# Altium schematic sheet Supplies.SchDoc
size A4; SheetNumber: 2; SheetTotal: 2
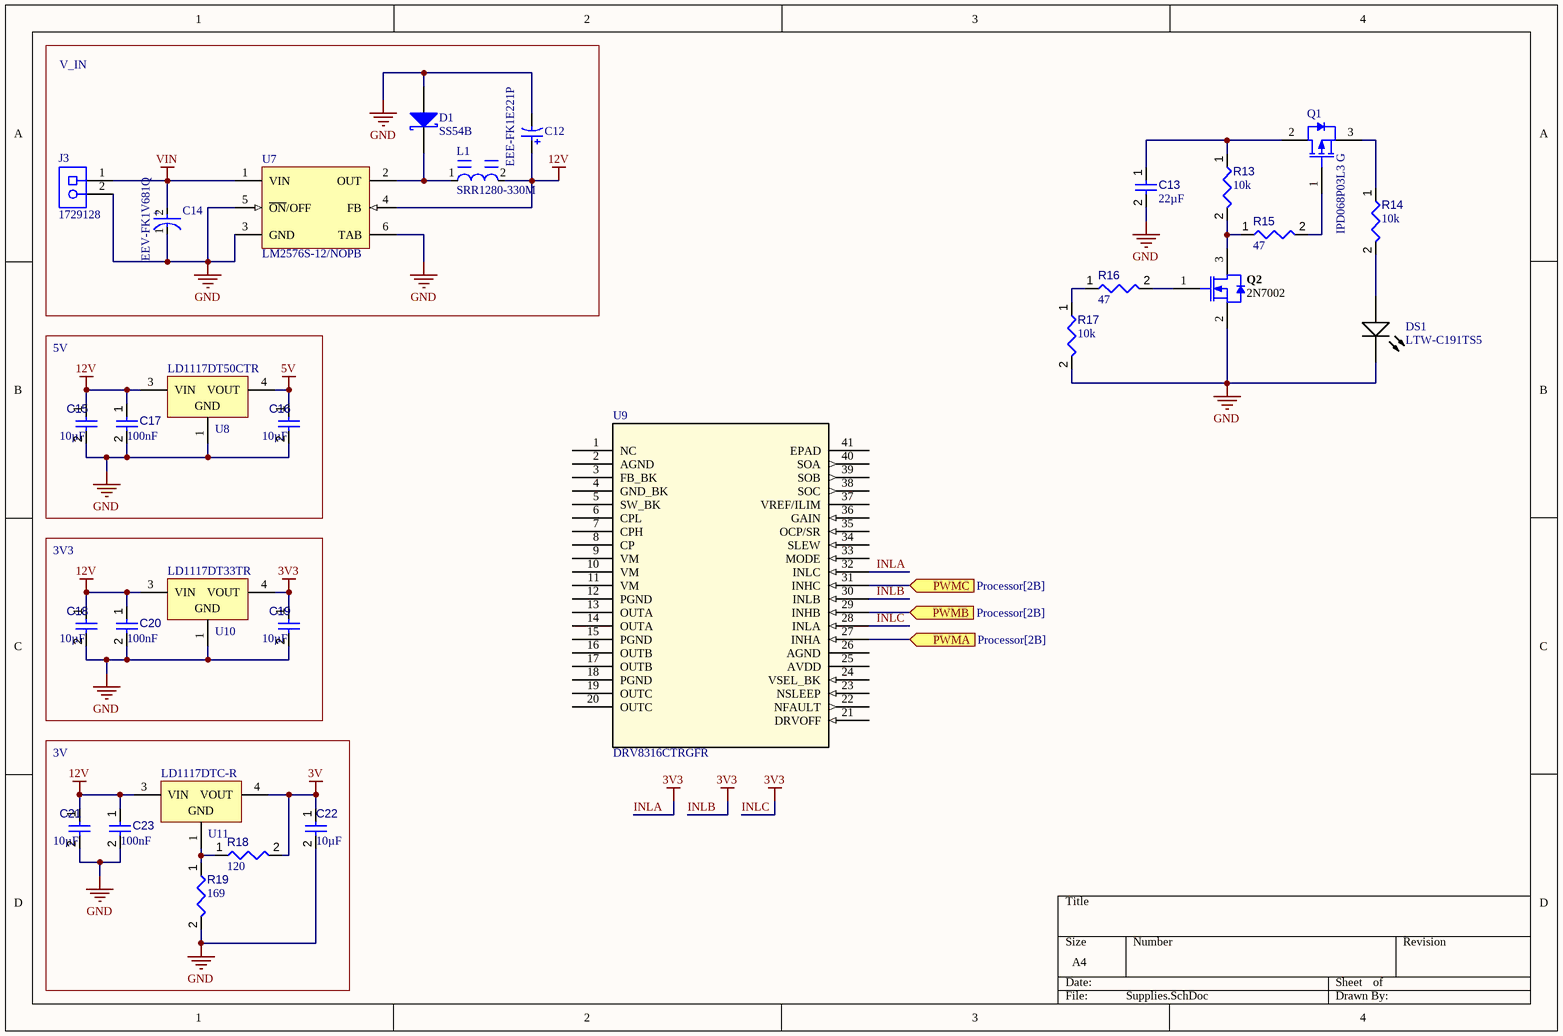
[diagram p0: Supplies.SchDoc]

## Parts
C12  EEE-FK1E221P  [PNSC-EEE-FK1E221P_N]
C13  value 22µF  [CAPC0805(2012)145_L]  (hidden comment: Capacitor 22µF +/-40% 16V 0805)
C14  EEV-FK1V681Q  [FP-FKH13-MFG]
C15  value 10µF  [CAPC0805(2012)145_L]  (hidden comment: Capacitor 22µF +/-40% 16V 0805)
C16  value 10µF  [CAPC0805(2012)145_L]  (hidden comment: Capacitor 22µF +/-40% 16V 0805)
C17  value 100nF  [CAPC1608X90X40NL10T20]  (hidden comment: Capacitor 100 nF +/-10% 50 V 0603)
C18  value 10µF  [CAPC0805(2012)145_L]  (hidden comment: Capacitor 22µF +/-40% 16V 0805)
C19  value 10µF  [CAPC0805(2012)145_L]  (hidden comment: Capacitor 22µF +/-40% 16V 0805)
C20  value 100nF  [CAPC1608X90X40NL10T20]  (hidden comment: Capacitor 100 nF +/-10% 50 V 0603)
C21  value 10µF  [CAPC0805(2012)145_L]  (hidden comment: Capacitor 22µF +/-40% 16V 0805)
C22  value 10µF  [CAPC0805(2012)145_L]  (hidden comment: Capacitor 22µF +/-40% 16V 0805)
C23  value 100nF  [CAPC1608X90X40NL10T20]  (hidden comment: Capacitor 100 nF +/-10% 50 V 0603)
D1  SS54B  [JCET-SMB-2_M]
DS1  LTW-C191TS5  [LTST-LTW-C191TS5_V]
J3  1729128  [PHOE-1729128-2_V]
L1  SRR1280-330M  [FP-SRR1280-MFG]
Q1  IPD068P03L3 G  [INF-PG-TO252-3-1_L]
Q2  2N7002  [INF-PG-SOT23_M]
R13  value 10k  [RESC1608X55X25ML10T15]  (hidden comment: Resistor 10k +/-1% 0603 100 mW)
R14  value 10k  [RESC1608X55X25ML10T15]  (hidden comment: Resistor 10k +/-1% 0603 100 mW)
R15  value 47  [RESC1608X55X25ML10T15]  (hidden comment: Resistor 10k +/-1% 0603 100 mW)
R16  value 47  [RESC1608X55X25ML10T15]  (hidden comment: Resistor 10k +/-1% 0603 100 mW)
R17  value 10k  [RESC1608X55X25ML10T15]  (hidden comment: Resistor 10k +/-1% 0603 100 mW)
R18  value 120  [RESC1608X55X25ML10T15]  (hidden comment: Resistor 10k +/-1% 0603 100 mW)
R19  value 169  [RESC1608X55X25ML10T15]  (hidden comment: Resistor 10k +/-1% 0603 100 mW)
U7  LM2576S-12/NOPB  [KTT0005B_N]
U8  LD1117DT50CTR  [TO-252_N]
U9  DRV8316CTRGFR  [VQFN40_RGF_TEX]
U10  LD1117DT33TR  [TO-252_N]
U11  LD1117DTC-R  [TO-252_M]

## Blocks framed on the sheet
V_IN: C12 C14 D1 J3 L1 U7
5V: C15-C17 U8
3V3: C18-C20 U10
3V: C21-C23 R18 R19 U11

## Ports
PWMA (in, see Processor[2B]), PWMB (in, see Processor[2B]), PWMC (in, see Processor[2B])

## Nets
3V: C22.1 R18.2 U11.4(VOUT)
5V: C16.1 U8.4(VOUT)
12V: C12.1 C15.1 C17.1 C18.1 C20.1 C21.1 C23.1 L1.2 U7.4(FB) U8.3(VIN) U10.3(VIN) U11.3(VIN)
GND: C12.2 C13.2 C14.1(C) C15.2 C16.2 C17.2 C18.2 C19.2 C20.2 C21.2 C22.2 C23.2 D1.1(A) DS1.2(K) J3.2 Q2.2(SOURCE) R17.2 R19.2 U7.3(GND) U7.5(~{ON}/OFF) U7.6(TAB) U8.1(GND) U10.1(GND)
INLA: C19.1 U9.28(INLA) U9.30(INLB) U9.32(INLC) U10.4(VOUT)  [also labelled 3V3, INLB, INLC]
VIN: C14.2(A) J3.1 U7.1(VIN)
PWMA: U9.27(INHA) ; port PWMA
PWMB: U9.29(INHB) ; port PWMB
PWMC: U9.31(INHC) ; port PWMC
NetC13_1: C13.1 Q1.2(DRAIN) R13.1
NetD1_2: D1.2(K) L1.1 U7.2(OUT)
NetDS1_1: DS1.1(A) R14.2
NetQ1_1: Q1.1(GATE) R15.2
NetQ1_3: Q1.3(SOURCE) R14.1
NetQ2_1: Q2.1(GATE) R16.2
NetQ2_3: Q2.3(DRAIN) R13.2 R15.1
NetR16_1: R16.1 R17.1
NetR18_1: R18.1 R19.1 U11.1(GND)

Not connected (* = marked no-connect by the designer): U9 1(NC) 2(AGND) 3(FB_BK) 4(GND_BK) 5(SW_BK) 6(CPL) 7(CPH) 8(CP) 9(VM) 10(VM) 11(VM) 12(PGND) 13(OUTA) 14(OUTA) 15(PGND) 16(OUTB) 17(OUTB) 18(PGND) 19(OUTC) 20(OUTC) 21(DRVOFF) 22(NFAULT) 23(NSLEEP) 24(VSEL_BK) 25(AVDD) 26(AGND) 33(MODE) 34(SLEW) 35(OCP/SR) 36(GAIN) 37(VREF/ILIM) 38(SOC) 39(SOB) 40(SOA) 41(EPAD)

## Notes on the sheet
- (in symbol CMP-05427-002172-1) +

## Library data of the parts
C12 = CMP-1665-00017-3: Aluminum Electrolytic Capacitor, 220 uF, +/- 20%, 25 V, -55 to 105 degC, 2-Pin CAPAE, RoHS, Tape and Reel; Manufacturer: Panasonic; Voltage Rating: 25 V; ComponentLink2URL: http://industrial.panasonic.com/cdbs/www-data/pdf/RDE0000/ABA0000C1181.pdf; Height: 10.2 mm; Max Operating Temperature: 105 degC; PackageReference: EEE-FK1E221P; ComponentLink1Description: Manufacturer URL; ComponentLink1URL: http://www.panasonic.com/; Mount: Surface Mount; REACH SVHC: No SVHC; Min Operating Temperature: -55 degC; ComponentLink2Description: Datasheet; DatasheetVersion: 03/2016; Length: 10.2 mm; RoHSCompliant: true; Packaging: Tape and Reel; Package Quantity: 500; Lead Pitch: 3.1 mm; Pins: 2; PackageDescription: 2-Pin Electrolytic Aluminum Capacitor, Body 8.3 x 8.3 mm; Mounting Technology: Surface Mount
C13 C15 C16 C18 C19 C21 C22 = CMP-001-00081-4: Chip Capacitor, 22µF +/-40%, 16V, 0805, Thickness 1.45 mm; Tolerance: 5%; Voltage Rating: 16V; Mounting Technology: SMT; Pins: 2; Max Operating Temperature: 85°C; Case/Package: 0805; Min Operating Temperature: -55°C
C14 = CMP-05427-002172-1: CAP ALUM 680UF 20% 35V SMD; Ripple Current (AC): 1.1A; Life (Hours): 5000Hour; Material: Aluminium; ESR (Equivalent Series Resistance): 60mR; Leakage Current: 3uA; Max Operating Temperature: 105°C; Min Operating Temperature: -55°C; Reach SVHC Compliant: Yes; Radiation Hardening: No; Length: 14mm; Package Quantity: 200; Width: 900um; Mount: Surface Mount; Ripple Current: 1.1A; Lead Free: Lead Free; Case/Package: Radial; Voltage Rating (DC): 35V; Termination: SMD/SMT; Capacitance: 680uF; Series: FK; Packaging: Tape and Reel; Voltage: 35V; Height: 13.5mm; Construction: Cylindrical; Voltage Rating: 35V; Ratings: AEC-Q200; Contact Plating: Tin; Impedance: 60mR; Height - Seated (Max): 0.531inch; Diameter: 12.5mm; RoHS Compliant: Yes; Tolerance: 20%
C17 C20 C23 = CMP-001-00017-6: Chip Capacitor, 100 nF, +/- 10%, 50 V, 0603 (1608 Metric); Capacitor Type: Ceramic; Voltage Rating: 50V; Max Operating Temperature: 125°C; Min Operating Temperature: -55°C; Case/Package: 0603; Mounting Technology: SM; Pins: 2; Tolerance: 10%; RoHS Compliant: True
D1 = CMP-2100-03685-1: Schottky Barrier Rectifier, 40 V, 5 A, -55 to 150 degC, 2-Pin SMD; Manufacturer: JCET; Datasheet URL: http://wiki.seeedstudio.com/images/3/3f/0310130P1.pdf; Package Description: 2-Pin Surface Mount Device, Body 4.315 x 3.62 mm; Datasheet Version: 41395.0; Package Reference: SMB-2; Manufacturer URL: http://www.cj-elec.com/
DS1 = CMP-007-00027-2: LED Uni-Color White, 70 mW, 20 mA, -20 to 80 degC, 2-Pin SMD, RoHS, Tape and Reel; Manufacturer: Lite-On; Power: 70mW; Forward Current: 5mA; Viewing Angle: 130degrees; Luminous Intensity: 28mcd; Lens Style: Diffused; Nominal Vf: 2.93V; Forward Voltage: 3.15V; Pins: 2; Illumination Colour: White; Datasheet Version: Rev. B, 06/2010; Package Quantity: 1; Colour: White; Package Reference: LTW-C191TS5; Mounting Technology: SM; Package Description: 2-Pin Surface Mount Device, Body 1.6 x 0.8 mm; Manufacturer URL: http://www.us.liteon.com/; Datasheet URL: http://optoelectronics.liteon.com/upload/download/DS22-2004-201/S_110_LTW-C191TS5.pdf; Max Operating Temperature: 80°C; Case/Package: 0603; RoHS Compliant: True; Min Operating Temperature: -20°C; Packaging: TapeandReel
J3 = CMP-2000-05815-1: PCB Terminal Block, 13.5 A, 400 V, 2-Pin THD, RoHS, Bulk; Manufacturer: Phoenix Contact; Package Version: 03/2015; No. of Rows: 1; Pitch: 5.08mm; No. of Positions: 2; Voltage Rating: 400V; Current Rating: 13500mA; Manufacturer URL: http://www.phoenixcontact.com/; Datasheet URL: https://datasheet.ciiva.com/16046/1729128-16046181.pdf; RoHS: TRUE; Package URL: https://www.phoenixcontact.com/online/portal/pi/pxc/product_detail_page/!ut/p/b1/3VdJjqNKFDxLH8AFycySyWY2ozFsEPOMMQaDOX1XedGL_1Vdm5YXJleknhSKeBkvI6EA8ncAo3AYoDhBQGco6KN7VURTdemj9us_IEKEZo_YHiPAEWEFmDGOHMORkqKYCORBZxgL7ZoaZYcbFFUZ3fqxSY6GOuxydWUuHqz1ynmMFygu583Bob0Ewr6Sd_l-5m-kAueHiB0jpRwZwe58wwtkpxtMYd_LmGcDRU02dRNEyWt6Y2ti5pSyJ_reIkzIulrqApdnbT11V5jnCKbYNCvhEM1MCpPByat_X379-iThf08CI5GfOPqfBeS3BRoBOdD55AKVv0iLwCMq-2BrzXWSGRH7pUGD9uwXQjiph3xL0DKQwdGa0JImiIOmBNOestqgwTHSSs2oOep-78apyXQBvNi8ZLaFjvjWvcaUEBu0MC6Wbe-d6mB0FAebo2lUWinqYaZs5DAYzV0RP9yitUjnGJ0iI9xhZkT42OCQNUJJhkgWINNQLP2JFP6OpMg3JCVg70jqHT0lvKOnhHf0lPuOnnLf0VPuWx6_dxwUIvwk5WMkT0kLL1mh61l2yZVSzG3pYV_bqo-mj6uMKwKwdnnW8Jh5RTOJzMOA5c-eJDaZQw4mTMPH02PvS_ZAqNVjVTo2WyYLkwH_KU1mmmG5kjRhDqPXLwwVHvVOjCM60-fpXvTDfMGW1PVFVS1r4e4yVDk4ZdNbkUHvqPqQSeian4UD39fNKmachqdJ1NJbyk8rXT9mXTvPk3oE5meulKGgiruPJek-4I9hTT6G8ZLOyRSm2RRVbThERQad5OS28hdt4YW4vG0stgYYzsWsK4_7y6DZMjJSCqri1kyiZR5vD7pwIrNR7QwPHTcLTI5qT7eRlpHrdGiupYlqQDJ7zy_CND8fWWBoLRXxk1RVcXiBQwbTD4Xi7KL-FuO94t9xaqweXzH; PartNumber: 1729128; Package Description: 2-Pin Through Hole Device, Body 8.1 x 10.16 mm, Pitch 5.08 mm; Datasheet Version: 12/2013; Mounting Technology: ThroughHole; Orientation: Horizontal; Package Reference: 1729128-2; Packing: Bulk
L1 = CMP-2000-07148-2: FIXED IND 33UH 3.5A 57 MOHM SMD; Self Resonant Frequency: 9.5MHz; Saturation Current: 3.3A; Shielding: Shielded; Test Frequency: 100kHz; Core Material: Ferrite; Tolerance: 20%; Q Factor: 28; Resistance: 57MR; Material: Steel; RMS Current (Irms): 3.5A; Max DC Current: 3.5A; Height: 7.5mm; Frequency: 9.5MHz; Series: SRR1280; Length: 12.5mm; Military Standard: Not; Height - Seated (Max): 0.315inch; REACH SVHC: No SVHC; Inductance: 33uH; DC Current: 3.5A; Current Rating: 3.5A; Sample Rate (Hz): 100kHz; Min Operating Temperature: -40°C; RoHS Compliant: Yes; Width: 12.5mm; Packaging: Tape and Reel; Inductance Tolerance: 20%; Case/Package: Nonstandard; Radiation Hardening: No; Max Operating Temperature: 125°C; Number of Pins: 2; Depth: 12.8mm; Mount: Surface Mount; Termination: SMD/SMT; Package Quantity: 400; DC Resistance (DCR): 57mR; Resistor Type: Wirewound
Q1 = CMP-1099-00059-1: P-Channel OptiMOS P3 Power-Transistor, -30 V VDS, -70 A ID, -55 to 175 degC, PG-TO252-3-1, Reel, Green; Manufacturer: Infineon; VDS (max): -30Â V; ID (max): -70Â A; RDS (on) (max): 6.8Â mOhm; Green: TRUE; IDpuls (max): -280Â A; VGS(th) (min): -1Â V; VGS(th) (max): -2Â V; Pto t (max): 100Â W; QG: 68Â nC; RDS (on) (max) (@4.5V): 11Â mOhm; RthJC (max): 1.5 K/W; Rth: 1.5Â K/W; ComponentLink2URL: http://www.infineon.com/dgdl/IPD068P03L3+G_2+0.pdf?folderId=db3a304314dca38901154a7313d21a66&fileId=db3a30432313ff5e01232cc234f07d94; PackageReference: PG-TO252-3-1; ComponentLink3URL: http://www.infineon.com/dgdl/TLE42744_DS_11.pdf?folderId=db3a304318f3fe290118f5a433570040&fileId=db3a304327b897500128012ccafe37d2&sId=db3a30443d67b5ca013d83f7c0ea327b; Packing: Reel; PackageDescription: 3-Pin Plastic (Green) Transistor Single Outline Package, 6.5 x 6.12 mm Body, 2.28 mm Pitch; ComponentLink3Description: Package Specification; DatasheetVersion: Rev. 2.0; ComponentLink1Description: Manufacturer URL; ComponentLink2Description: Datasheet; PackageVersion: Jan-10; Mounting Technology: Surface Mount; ComponentLink1URL: http://www.infineon.com/; PartNumber: IPD068P03L3 G
Q2 = CMP-1149-00026-1: N-Channel OptiMOS Small-Signal-Transistor, 60 V VDS, 0.3 A ID, -55 to 150 degC, PG-SOT23, Reel, Green; Manufacturer: Infineon; RDS (on) (max) (@4.5V): 4,000 mOhm; VDS (max): 60 V; IDpuls (max): 1.2Â A; QG: 0.4Â nC; RDS (on) (max): 3,000 mOhm; RthJA (max): 250 K/W; ID (max): 0.3Â A; VGS(th) (max): 2.5Â V; VGS(th) (min): 1.5Â V; Green: TRUE; Ptot (max): 0.5Â W; PackageDescription: 3-Pin Small Outline Transistor Package, 2.9 x 1.3 mm Body, 0.95 mm Pitch; Halogen-free: TRUE; ComponentLink2Description: Datasheet; ComponentLink1URL: http://www.infineon.com/; Packing: Reel; DatasheetVersion: Rev. 2.4; PartNumber: 2N7002; PackageReference: PG-SOT23; PackageVersion: Apr-08; ComponentLink3URL: http://www.infineon.com/dgdl/SOT23-Package_Overview.pdf?folderId=db3a30431936bc4b0119532290053c66&fileId=db3a30431936bc4b0119533468123c85; ComponentLink1Description: Manufacturer URL; Mounting Technology: Surface Mount; ComponentLink3Description: Package Specification; ComponentLink2URL: http://www.infineon.com/dgdl/2N7002_Rev2.4.pdf?folderId=db3a3043156fd573011622e10b5c1f67&fileId=db3a304319bc939a0119c2a9461e79e6
R13-R19 = CMP-009-00017-5: Chip Resistor, 10 KOhm, +/- 1%, 01 W, -55 to 155 degC, 0603 (1608 Metric); Voltage Rating: 50V; Power: 100mW; RoHS Compliant: True; Min Operating Temperature: -55°C; Pins: 2; Case/Package: 0603; Mounting Technology: SM; Max Operating Temperature: 155°C; Tolerance: 1%
U7 = CMP-0069-00125-3: SIMPLE SWITCHER® 3A Step-Down Voltage Regulator, 5-pin TO-263, Pb-Free; Manufacturer: Texas Instruments; PackageTopMarking: NSUZXYTTE#*LM2576S*-12 P+; PowerWise: N; ComponentLink1URL: http://www.ti.com/general/docs/lit/getliterature.tsp?genericPartNumber=LM2576&fileType=pdf; RoHS: Y; Code_JEDEC: MO-169-AB; ComponentLink1Description: Datasheet URL; PinCount: 5; PackageDescription: TO-263, Molded, .400 x .390 x .180in, 5 Lead, .067in Pitch, Surface Mount; PackageReference: KTT0005B; CompType: Switcher
U8 = CMP-0244-00109-1: Fixed Low Drop Positive Voltage Regulator, 5V, 3-Pin DPAK, Tape and Reel; ComponentLink2URL: http://www.st.com/internet/com/TECHNICAL_RESOURCES/TECHNICAL_LITERATURE/DATASHEET/CD00000544.pdf; ComponentLink1URL: http://www.st.com; PackageReference: TO-252; DatasheetVersion: 1/11/2011; ComponentLink1Description: Manufacturer URL; PackageVersion: 2011; ComponentLink2Description: Datasheet; PackageDescription: 3-Pin Transistor Outline Package 2.28 mm Pitch, 9.7 mm Lead Span (DPAK)
U9 = DRV8316CTRGFR: No Description Available; Mfr_Name: Texas Instruments; Type: DEV; Copyright: Copyright (C) 2024 Ultra Librarian. All rights reserved.; Manufacturer_Part_Number: DRV8316CTRGFR; RefDes: RefDes
U10 = CMP-0244-00088-1: Fixed Low Drop Positive Voltage Regulator, 3.3V, 3-Pin DPAK, Tape and Reel; ComponentLink1Description: Manufacturer URL; PackageVersion: 2011; PackageReference: TO-252; ComponentLink2Description: Datasheet; ComponentLink1URL: http://www.st.com; DatasheetVersion: 1/11/2011; PackageDescription: 3-Pin Transistor Outline Package 2.28 mm Pitch, 9.7 mm Lead Span (DPAK); ComponentLink2URL: http://www.st.com/internet/com/TECHNICAL_RESOURCES/TECHNICAL_LITERATURE/DATASHEET/CD00000544.pdf
U11 = CMP-0244-00107-1: Adjustable Low Drop Voltage Regulator, 1.25 to 15V, 3-Pin DPAK, Tape and Reel; ComponentLink2URL: http://www.st.com/internet/com/TECHNICAL_RESOURCES/TECHNICAL_LITERATURE/DATASHEET/CD00000544.pdf; ComponentLink1Description: Manufacturer URL; DatasheetVersion: 1/11/2011; PackageVersion: 2011; PackageDescription: 3-Pin Transistor Outline Package 2.28 mm Pitch, 9.7 mm Lead Span (DPAK); ComponentLink2Description: Datasheet; ComponentLink1URL: http://www.st.com; PackageReference: TO-252